# Altium schematic sheet 9.TEMP.SchDoc: TEMPERATURE AND HUMIDITY SENSOR
size A; SheetNumber: 9; SheetTotal: 16
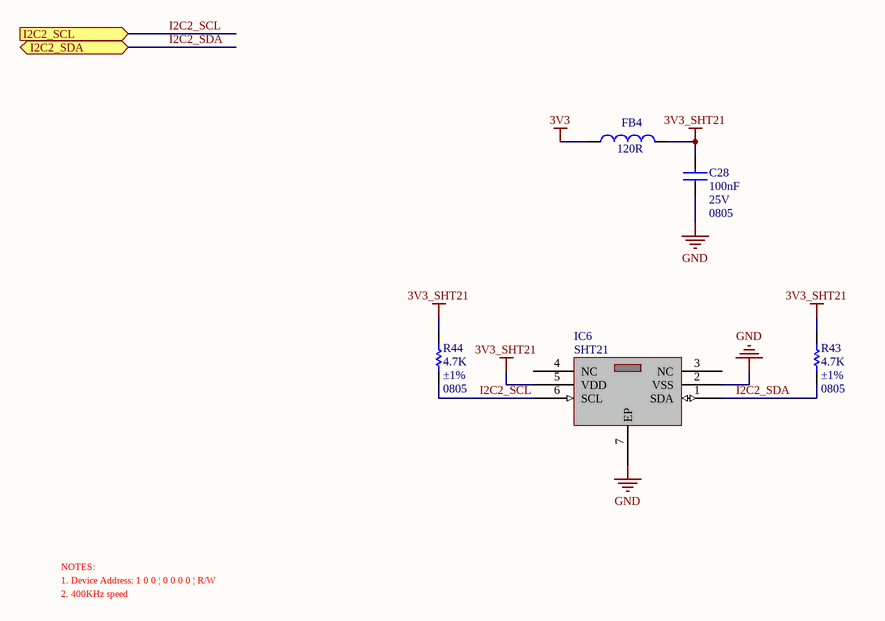
[diagram p0: 9.TEMP.SchDoc]

## Parts
C28  Capacitance: 100nF  Voltage - Rated: 25V  Package / Case: 0805  [CAPC2012X100N_EIA0805]  (hidden comment: CAP_NP)
FB4  Impedance: 120R  [FILC2012X100N_EIA0805]  (hidden comment: BEAD)
IC6  SHT21  [SHT21]
R43  Resistance (Ohm): 4.7K  Tolerance: ±1%  Package / Case: 0805  [RESC2013X65N_EIA0805]  (hidden comment: RES)
R44  Resistance (Ohm): 4.7K  Tolerance: ±1%  Package / Case: 0805  [RESC2013X65N_EIA0805]  (hidden comment: RES)

## Ports
I2C2_SCL (in), I2C2_SDA (bidir)

## Nets
3V3: FB4.1
3V3_SHT21: C28.2 FB4.2 IC6.5(VDD) R43.2 R44.2
GND: C28.1 IC6.2(VSS) IC6.7(EP)
I2C2_SCL: IC6.6(SCL) R44.1 ; port I2C2_SCL
I2C2_SDA: IC6.1(SDA) R43.1 ; port I2C2_SDA

Not connected (* = marked no-connect by the designer): IC6 3(NC) 4(NC)

## Notes on the sheet
- NOTES:
- 1. Device Address: 1 0 0 | 0 0 0 0 | R/W
- 2. 400KHz speed

## Library data of the parts
C28 = SCAP00300093: CAP CER 0.1UF 25V X7R 0805; Manufacturer: Samsung Electro-Mechanics America, Inc.; Manufacturer Part Number: CL21B104KACNNNC; Value: 100nF; Tolerance: ±10%; Type: Multi Layer Ceramic Capacitor  (MLCC); Cost x1 ($): 0.10000; Cost x10 ($): 0.03300; Cost x100 ($): 0.01470; Cost x1000 ($): 0.00825; Distrubutor: Digikey; Lead Time: 11 Weeks; Part Number: SCAP00300093; Temperature Coefficient: X7R; Operating Temperature: -55°C ~ 125°C; Mounting Type: Surface Mount, MLCC; Size / Dimension: 0.079" L x 0.049" W (2.00mm x 1.25mm); Category: Capacitors; Family: Ceramic Capacitors; Distributor Part Number: 1276-1099-1-ND; Distributor Link: http://www.digikey.com/product-detail/en/samsung-electro-mechanics-america-inc/CL21B104KACNNNC/1276-1099-1-ND/3889185; ROHS: YES; Moisture Sensitivity Level (MSL): 1 (Unlimited); Quantity: 50
FB4 = SFIL00005: FERRITE CHIP POWER 120 OHM SMD; Manufacturer: Laird-Signal Integrity Products; Manufacturer Part Number: HI0805O121R-10; Type: Differential Mode - Single; Current Rating: 3.5A; DC Resistance (DCR): 20 mOhm Max; Cost x10 ($): 0.08700; Cost x100 ($): 0.05230; Cost x1000 ($): 0.03010; Distrubutor: Digikey; Cost x1 ($): 0.10000; Part Number: SFIL00005; Package / Case: 0805 (2012 Metric); Value: BEAD; Category: Filters; Family: Ferrite Beads and Chips; Distributor Part Number: 240-2393-1-ND; ROHS: YES; Datasheet Link: http://www.digikey.com/product-detail/en/HI0805O121R-10/240-2393-1-ND/806753; Quantity: 50
IC6 = SSEN00014: HUMIDITY AND TEMPERATURE SENSOR; Manufacturer: Sensirion AG; Voltage: 2.1 V ~ 3.6 V; Output Type: I²C; Sensor Type: Humidity, Temperature; Cost x10($): 7.07900; Cost x100 ($): 5.03360; Distrubutor: DigiKey; Lead Time: 4 Weeks; Cost x1 ($): 8.97000; Part Number: SSEN00014; Value: SHT21; Operating Temperature: -40°C ~ 125°C; Category: Sensors, Transducers; Family: Moisture Sensors, Humidity; Cost x1000 ($): 5.03360; Manufacturer Part Number: SHT21; Distributor Part Number: 1649-1005-1-ND; ROHS: YES; Distributor Link: http://www.digikey.com/product-detail/en/sensirion-ag/SHT21/1649-1005-1-ND/5872287; MSL: 1 (Unlimited); Quantity: 0
R43 R44 = SRES03010090: RES SMD 4.7K OHM 1% 1/8W 0805; Manufacturer: Yageo; Manufacturer Part Number: RC0805FR-074K7L; Power (Watts): 0.125W, 1/8W; Cost x1 ($): 0.10; Cost x10 ($): 0.21; Cost x100 ($): 0.84; Cost x1000 ($): 3.79; Distrubutor: Digikey; Part Number: SRES03010090; Value: 4.7K; Category: Resistors; Family: Chip Resistor - Surface Mount; Distributor Part Number: 311-4.70KCRCT-ND; Distributor Link: http://www.digikey.com/product-detail/en/RC0805FR-074K7L/311-4.70KCRCT-ND/730876; ROHS: YES; Quantity: 0